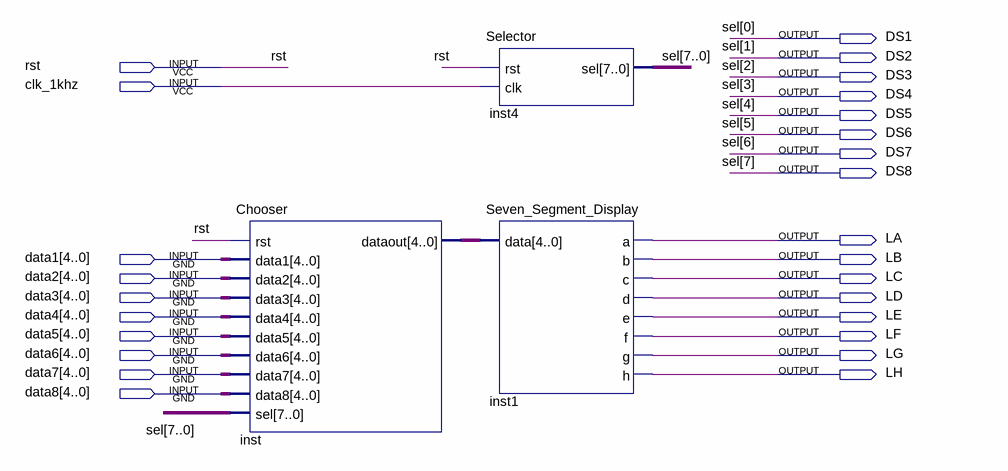
[diagram p0: schematic sheet]
// Quartus schematic Scanner.bdf as structural Verilog: 3 symbols, 26 pins
module Scanner (
  input  rst,
  input  clk_1khz,
  input  [4:0] data1,
  input  [4:0] data2,
  input  [4:0] data3,
  input  [4:0] data4,
  input  [4:0] data5,
  input  [4:0] data6,
  input  [4:0] data7,
  input  [4:0] data8,
  output DS1,
  output DS2,
  output DS3,
  output DS4,
  output DS5,
  output DS6,
  output DS7,
  output DS8,
  output LA,
  output LB,
  output LC,
  output LD,
  output LE,
  output LF,
  output LG,
  output LH
);

  wire [4:0] inst_dataout;

  Chooser inst (
    .rst(rst), .data1(data1), .data2(data2), .data3(data3), .data4(data4), .data5(data5), .data6(data6),
    .data7(data7), .data8(data8), .sel({DS8, DS7, DS6, DS5, DS4, DS3, DS2, DS1}), .dataout(inst_dataout));
  Selector inst4 (.rst(rst), .clk(clk_1khz), .sel({DS8, DS7, DS6, DS5, DS4, DS3, DS2, DS1}));
  Seven_Segment_Display inst1 (.data(inst_dataout), .a(LA), .b(LB), .c(LC), .d(LD), .e(LE), .f(LF), .g(LG), .h(LH));

  // Other names for the same wires on the sheet: sel[7:0] = {DS8, DS7, DS6, DS5, DS4, DS3, DS2, DS1}
endmodule
